# Altium schematic sheet Battery PSU.SchDoc
size A4
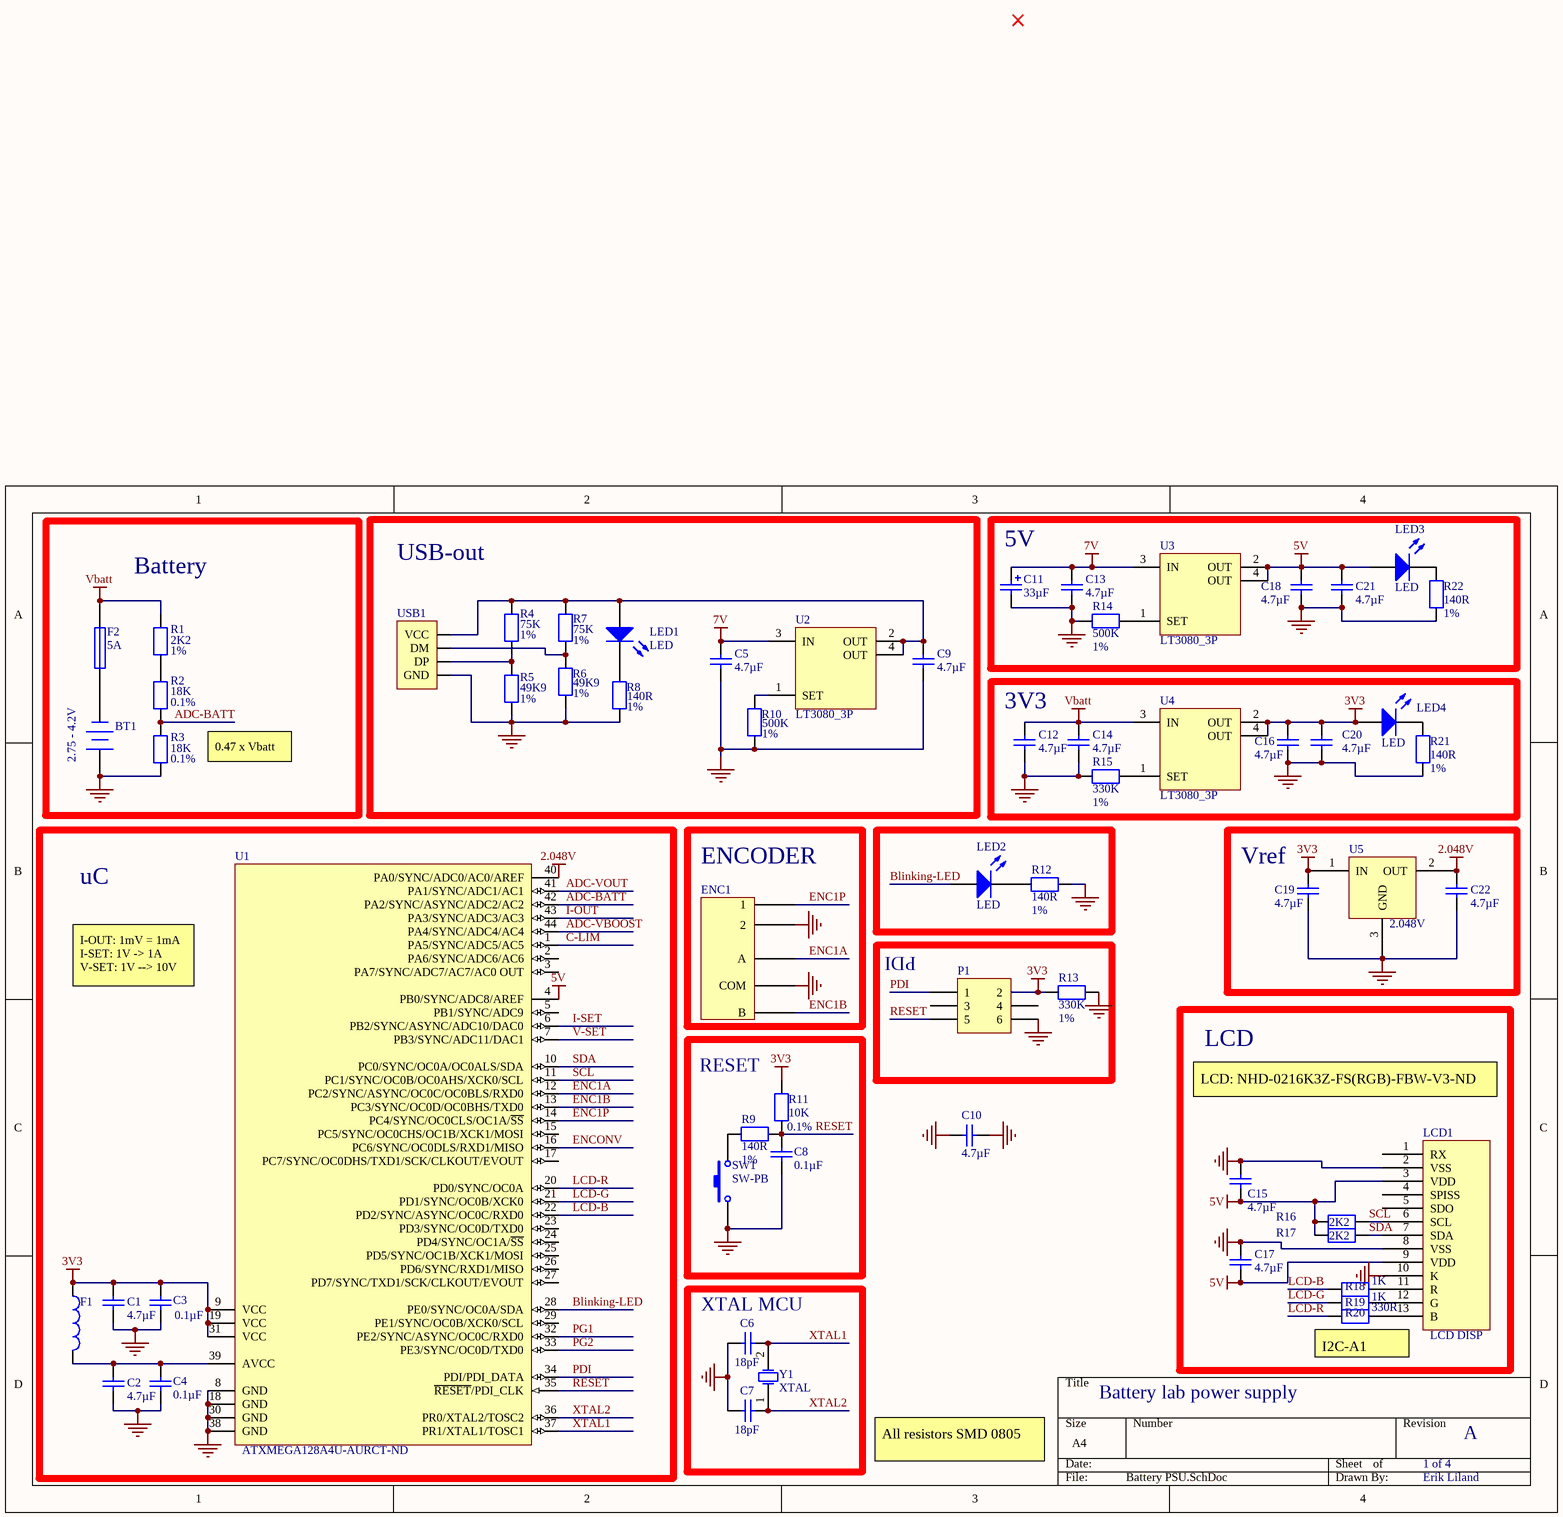
[diagram p0: Battery PSU.SchDoc]

## Parts
BT1  2.75 - 4.2V  [Quad battery holder]
C1  4.7µF  [0805_N_CAP]
C2  4.7µF  [0805_N_CAP]
C3  0.1µF  [0805_N_CAP]
C4  0.1µF  [0805_N_CAP]
C5  4.7µF  [0805_N_CAP]
C6  18pF  [0805_N_CAP]
C7  18pF  [0805_N_CAP]
C8  0.1µF  [0805_N_CAP]
C9  4.7µF  [0805_N_CAP]
C10  4.7µF  [0805_N_CAP]
C11  33µF  [CAP SMD (F)]
C12  4.7µF  [0805_N_CAP]
C13  4.7µF  [0805_N_CAP]
C14  4.7µF  [0805_N_CAP]
C15  4.7µF  [0805_N_CAP]
C16  4.7µF  [0805_N_CAP]
C17  4.7µF  [0805_N_CAP]
C18  4.7µF  [0805_N_CAP]
C19  4.7µF  [0805_N_CAP]
C20  4.7µF  [0805_N_CAP]
C21  4.7µF  [0805_N_CAP]
C22  4.7µF  [0805_N_CAP]
ENC1  RotEnc  [Bourns rotary encoder]  (value not drawn)
F1  200 Ohm @ 100MHz  [0805_N_FER]  (value not drawn)
F2  5A  [1812_N_FUSE]
LCD1  LCD DISP  [14P header]
LED1  LED  [0805_N_LED]
LED2  LED  [0805_N_LED]
LED3  LED  [0805_N_LED]
LED4  LED  [0805_N_LED]
P1  Header 3X2  [HDR2X3 SMD]  (value not drawn)
R1  2K2  Tolerance: 1%  [0805_N_RES]
R2  18K  Tolerance: 0.1%  [0805_N_RES]
R3  18K  Tolerance: 0.1%  [0805_N_RES]
R4  75K  Tolerance: 1%  [0805_N_RES]
R5  49K9  Tolerance: 1%  [0805_N_RES]
R6  49K9  Tolerance: 1%  [0805_N_RES]
R7  75K  Tolerance: 1%  [0805_N_RES]
R8  140R  Tolerance: 1%  [0805_N_RES]
R9  140R  Tolerance: 1%  [0805_N_RES]
R10  500K  Tolerance: 1%  [0805_N_RES]
R11  10K  Tolerance: 0.1%  [0805_N_RES]
R12  140R  Tolerance: 1%  [0805_N_RES]
R13  330K  Tolerance: 1%  [0805_N_RES]
R14  500K  Tolerance: 1%  [0805_N_RES]
R15  330K  Tolerance: 1%  [0805_N_RES]
R16  2K2  [0805_N_RES]
R17  2K2  [0805_N_RES]
R18  1K  [0805_N_RES]
R19  1K  [0805_N_RES]
R20  330R  [0805_N_RES]
R21  140R  Tolerance: 1%  [0805_N_RES]
R22  140R  Tolerance: 1%  [0805_N_RES]
SW1  SW-PB  [SW TACTILE]
U1  Supplier Part Number 1: ATXMEGA128A4U-AURCT-ND  [44A_N]  (hidden comment: ATxmega128A4-AU)
U2  LT3080_3P  [SOT223_N]
U3  LT3080_3P  [SOT223_N]
U4  LT3080_3P  [SOT223_N]
U5  2.048V  [SOT-23_N]
USB1  USB_A_VERT  [USB A VERT]  (value not drawn)
Y1  XTAL  [XTAL SMD]

## Blocks framed on the sheet
Battery: BT1 F2 R1-R3
USB-out: C5 C9 LED1 R4-R8 R10 U2 USB1
5V: C11 C13 C18 C21 LED3 R14 R22 U3
3V3: C12 C14 C16 C20 LED4 R15 R21 U4
uC: C1-C4 F1 U1
ENCODER: ENC1
Vref: C19 C22 U5
PDI: P1 R13
RESET: C8 R9 R11 SW1
LCD: C15 C17 LCD1 R16-R20
XTAL MCU: C6 C7 Y1

## Nets
2.048V: C22.1 U1.40(PA0/SYNC/ADC0/AC0/AREF) U5.2(OUT)
3V3: C1.1 C3.2 C16.1 C19.1 C20.1 F1.1 LED4.1(A) P1.2 R11.1 R13.2 U1.9(VCC) U1.19(VCC) U1.31(VCC) U4.2(OUT) U4.4(OUT) U5.1(IN)
5V: C15.2 C17.2 C18.1 C21.1 LCD1.3(VDD) LCD1.9(VDD) LED3.1(A) R16.2 R17.2 U1.4(PB0/SYNC/ADC8/AREF) U3.2(OUT) U3.4(OUT)
7V: C5.1 C11.1 C13.1 U2.3(IN) U3.3(IN)
GND: BT1.1(+) C1.2 C2.2 C3.1 C4.1 C5.2 C6.1 C7.1 C8.1 C9.2 C10.1 C10.2 C11.2 C12.2 C13.2 C14.2 C15.1 C16.2 C17.1 C18.2 C19.2 C20.2 C21.2 C22.2 ENC1.C(COM) ENC1.E(2) LCD1.2(VSS) LCD1.8(VSS) LCD1.10(K) P1.6 R3.2 R5.1 R6.1 R8.1 R10.1 R12.1 R13.1 R14.2 R15.2 R21.2 R22.2 SW1.1 U1.8(GND) U1.18(GND) U1.30(GND) U1.38(GND) U5.3(GND) USB1.4(GND)
Vbatt: C12.1 C14.1 F2.1 R1.2 U4.3(IN)
ADC-BATT: R2.2 R3.1 U1.42(PA2/SYNC/ASYNC/ADC2/AC2)
ADC-VBOOST: U1.44(PA4/SYNC/ADC4/AC4)
ADC-VOUT: U1.41(PA1/SYNC/ADC1/AC1)
Blinking-LED: LED2.1(A) U1.28(PE0/SYNC/OC0A/SDA)
C-LIM: U1.1(PA5/SYNC/ADC5/AC5)
ENC1A: ENC1.A U1.12(PC2/SYNC/ASYNC/OC0C/OC0BLS/RXD0)
ENC1B: ENC1.B U1.13(PC3/SYNC/OC0D/OC0BHS/TXD0)
ENC1P: ENC1.D(1) U1.14(PC4/SYNC/OC0CLS/OC1A/~{SS})
ENCONV: U1.16(PC6/SYNC/OC0DLS/RXD1/MISO)
I-OUT: U1.43(PA3/SYNC/ADC3/AC3)
I-SET: U1.6(PB2/SYNC/ASYNC/ADC10/DAC0)
LCD-B: R18.2 U1.22(PD2/SYNC/ASYNC/OC0C/RXD0)
LCD-G: R19.2 U1.21(PD1/SYNC/OC0B/XCK0)
LCD-R: R20.2 U1.20(PD0/SYNC/OC0A)
PDI: P1.1 U1.34(PDI/PDI_DATA)
PG1: U1.32(PE2/SYNC/ASYNC/OC0C/RXD0)
PG2: U1.33(PE3/SYNC/OC0D/TXD0)
RESET: C8.2 P1.5 R9.2 R11.2 U1.35(~{RESET}/PDI_CLK)
SCL: LCD1.6(SCL) R16.1 U1.11(PC1/SYNC/OC0B/OC0AHS/XCK0/SCL)
SDA: LCD1.7(SDA) R17.1 U1.10(PC0/SYNC/OC0A/OC0ALS/SDA)
V-SET: U1.7(PB3/SYNC/ADC11/DAC1)
XTAL1: C6.2 U1.37(PR1/XTAL1/TOSC1) Y1.2(OSC2)
XTAL2: C7.2 U1.36(PR0/XTAL2/TOSC2) Y1.1(OSC1)
NetBT1_2: BT1.2(-) F2.2
NetC2_1: C2.1 C4.2 F1.2 U1.39(AVCC)
NetC9_1: C9.1 LED1.1(A) R4.2 R7.2 U2.2(OUT) U2.4(OUT) USB1.1(VCC)
NetLCD1_11: LCD1.11(R) R18.1
NetLCD1_12: LCD1.12(G) R19.1
NetLCD1_13: LCD1.13(B) R20.1
NetLED1_2: LED1.2(K) R8.2
NetLED2_2: LED2.2(K) R12.2
NetLED3_2: LED3.2(K) R22.1
NetLED4_2: LED4.2(K) R21.1
NetR1_1: R1.1 R2.1
NetR4_1: R4.1 R5.2 USB1.3(DP)
NetR6_2: R6.2 R7.1 USB1.2(DM)
NetR9_1: R9.1 SW1.2
NetR10_2: R10.2 U2.1(SET)
NetR14_1: R14.1 U3.1(SET)
NetR15_1: R15.1 U4.1(SET)

Not connected (* = marked no-connect by the designer): LCD1 1(RX) 4(SPISS) 5(SDO); P1 3 4; U1 2(PA6/SYNC/ADC6/AC6) 3(PA7/SYNC/ADC7/AC7/AC0_OUT) 5(PB1/SYNC/ADC9) 15(PC5/SYNC/OC0CHS/OC1B/XCK1/MOSI) 17(PC7/SYNC/OC0DHS/TXD1/SCK/CLKOUT/EVOUT) 23(PD3/SYNC/OC0D/TXD0) 24(PD4/SYNC/OC1A/~{SS}) 25(PD5/SYNC/OC1B/XCK1/MOSI) 26(PD6/SYNC/RXD1/MISO) 27(PD7/SYNC/TXD1/SCK/CLKOUT/EVOUT) 29(PE1/SYNC/OC0B/XCK0/SCL)

## Notes on the sheet
- 0.47 x Vbatt
- (near U1) I-OUT: 1mV = 1mA
  I-SET: 1V -> 1A
  V-SET: 1V --> 10V
- LCD: NHD-0216K3Z-FS(RGB)-FBW-V3-ND
- Battery lab power supply
- I2C-A1
- All resistors SMD 0805
- 1 of 4
- A
- Erik Liland

## Library data of the parts
BT1 = Battery: Multicell Battery; Manufacturer: MPD (Memory Protection Devices); Manufacturer Part Number: BK-18650-PC8; Battery Type, Function: Cylindrical, Holder; Style: Holder (Open); Battery Cell Size: 18650; Number of Cells: 4; Published: 24-Mar-1999; LatestRevisionDate: 17-Jul-2002; LatestRevisionNote: Re-released for DXP Platform.; PackageReference: BAT-2; Publisher: Altium Limited; PackageDescription: Battery; 2 Leads; Supplier 1: Digi-Key; Supplier Part Number 1: BK-18650-PC8-ND; RoHS: RoHS Compliant; Category: Battery Products; Stock 1: 771; Pricing 1: 1=5.87, 10=5.436, 100=4.8966, 500=4.18678, 1000=3.7136 (EUR); Battery Series: -; Mounting Type: PCB, Through Hole; Termination Style: PC Pin; Height Above Board: 0.848" (21.54mm); Operating Temperature: -; ComponentLink1URL: http://www.memoryprotectiondevices.com/datasheets/BK-18650-PC8-datasheet.pdf; ComponentLink1Description: http://www.memoryprotectiondevices.com/datasheets/BK-18650-PC8-datasheet.pdf
C1 C2 C5 C9 C10 C12-C22 = Cap: Capacitor; Manufacturer: Samsung Electro-Mechanics America, Inc; Manufacturer Part Number: CL21B475KOFNFNE; Tolerance: ±10%; Voltage - Rated: 16V; Temperature Coefficient: X7R; Supplier 1: Digi-Key; Supplier Part Number 1: 1276-2970-1-ND; RoHS: RoHS Compliant; Category: Capacitors; Stock 1: 58798; Pricing 1: 1=0.27, 10=0.18, 25=0.1308, 100=0.0915, 500=0.06538, 1000=0.05557 (EUR); Packaging: Cut Tape (CT); Capacitance: 4.7µF; Mounting Type: Surface Mount, MLCC; Operating Temperature: -55°C ~ 125°C; Package / Case: 0805 (2012 Metric); Size / Dimension: 0.079" L x 0.049" W (2.00mm x 1.25mm); Height - Seated (Max): -; Thickness (Max): 0.053" (1.35mm); ComponentLink1URL: http://www.samsungsem.com/kr/front/downloadcms.do?path=/kr/support/product-search/mlcc/__icsFiles/afieldfile/2014/11/05&fileName=S_CL21B475KOFNFNE.pdf; ComponentLink1Description: http://www.samsungsem.com/kr/front/downloadcms.do?path=/kr/support/product-search/mlcc/__icsFiles/afieldfile/2014/11/05&fileName=S_CL21B475KOFNFNE.pdf
C3 = Cap: Capacitor; Manufacturer: Kemet; Manufacturer Part Number: C0805C104K4RACTU; Tolerance: ±10%; Voltage - Rated: 16V; Temperature Coefficient: X7R; Capacitance: 0.1µF; Category: Capacitors; Supplier 1: Digi-Key; Supplier Part Number 1: 399-1167-1-ND; RoHS: RoHS Compliant; Stock 1: 286232; Pricing 1: 1=0.11, 10=0.076, 50=0.0436, 100=0.0359, 250=0.03024, 500=0.02534, 1000=0.02081 (EUR); Packaging: Cut Tape (CT); Mounting Type: Surface Mount, MLCC; Operating Temperature: -55°C ~ 125°C; Package / Case: 0805 (2012 Metric); Size / Dimension: 0.079" L x 0.049" W (2.00mm x 1.25mm); Height - Seated (Max): -; Thickness (Max): 0.035" (0.88mm); ComponentLink1URL: http://www.kemet.com/docfinder?Partnumber=C0805C104K4RACTU; ComponentLink1Description: http://www.kemet.com/docfinder?Partnumber=C0805C104K4RACTU
C4 C8 = Cap: Capacitor; Manufacturer: Kemet; Manufacturer Part Number: C0805C104K4RACTU; Temperature Coefficient: X7R; Tolerance: ±10%; Voltage - Rated: 16V; Capacitance: 0.1µF; Category: Capacitors; ComponentLink1Description: http://www.kemet.com/docfinder?Partnumber=C0805C104K4RACTU; ComponentLink1URL: http://www.kemet.com/docfinder?Partnumber=C0805C104K4RACTU; Height - Seated (Max): -; Mounting Type: Surface Mount, MLCC; Operating Temperature: -55°C ~ 125°C; Package / Case: 0805 (2012 Metric); Packaging: Cut Tape (CT); Pricing 1: 1=0.11, 10=0.076, 50=0.0436, 100=0.0359, 250=0.03024, 500=0.02534, 1000=0.02081 (EUR); RoHS: RoHS Compliant; Size / Dimension: 0.079" L x 0.049" W (2.00mm x 1.25mm); Stock 1: 286232; Supplier 1: Digi-Key; Supplier Part Number 1: 399-1167-1-ND; Thickness (Max): 0.035" (0.88mm)
C6 C7 = Cap: Capacitor; Manufacturer: Samsung Electro-Mechanics America, Inc; Manufacturer Part Number: CL21C180GBANNNC; Tolerance: ±2%; Voltage - Rated: 50V; Temperature Coefficient: C0G, NP0; Supplier 1: Digi-Key; Supplier Part Number 1: 1276-2594-1-ND; RoHS: RoHS Compliant; Category: Capacitors; Stock 1: 4722; Pricing 1: 1=0.09, 10=0.069, 25=0.0488, 100=0.0315, 500=0.02208, 1000=0.0172 (EUR); Packaging: Cut Tape (CT); Capacitance: 18pF; Mounting Type: Surface Mount, MLCC; Operating Temperature: -55°C ~ 125°C; Package / Case: 0805 (2012 Metric); Size / Dimension: 0.079" L x 0.049" W (2.00mm x 1.25mm); Height - Seated (Max): -; Thickness (Max): 0.030" (0.75mm); ComponentLink1URL: http://www.samsungsem.com/kr/front/downloadcms.do?path=/kr/support/product-search/mlcc/__icsFiles/afieldfile/2014/11/05&fileName=S_CL21C180GBANNNC.pdf; ComponentLink1Description: http://www.samsungsem.com/kr/front/downloadcms.do?path=/kr/support/product-search/mlcc/__icsFiles/afieldfile/2014/11/05&fileName=S_CL21C180GBANNNC.pdf
C11 = Cap Pol: Polarized Capacitor; Manufacturer: Panasonic Electronic Components; Manufacturer Part Number: EEH-ZA1E330R; Tolerance: ±20%; ESR (Equivalent Series Resistance): 80 mOhm; Lifetime @ Temp.: 10000 Hrs @ 105°C; Type: Polymer - Hybrid; Ripple Current: 900mA; Surface Mount Land Size: 0.209" L x 0.209" W (5.30mm x 5.30mm); Voltage - Rated: 25V; Supplier 1: Digi-Key; Supplier Part Number 1: P15438CT-ND; RoHS: RoHS Compliant; Category: Capacitors; Stock 1: 7514; Pricing 1: 1=1.58, 10=1.291, 25=1.1648, 50=1.1332, 100=1.0389, 250=0.91296, 500=0.85 (EUR); Packaging: Cut Tape (CT); Capacitance: 33µF; Operating Temperature: -55°C ~ 105°C; Size / Dimension: 0.197" Dia (5.00mm); Height - Seated (Max): 0.240" (6.10mm); Mounting Type: Surface Mount; Package / Case: Radial, Can - SMD; ComponentLink1URL: http://industrial.panasonic.com/www-data/pdf/ABA0000/ABA0000CE136.pdf; ComponentLink1Description: http://industrial.panasonic.com/www-data/pdf/ABA0000/ABA0000CE136.pdf
ENC1 = RotEnc: RotaryEncoder; Manufacturer: Bourns Inc.; Manufacturer Part Number: PEC09-2220F-S0012; Encoder Type: Mechanical; Output Type: Quadrature (Incremental); Pulses per Revolution: 12; Actuator Type: 6mm Dia Flatted End; Detent: Yes; Rotational Life (Cycles Min): 30K; Supplier 1: Digi-Key; Supplier Part Number 1: PEC09-2220F-S0012-ND; RoHS: RoHS Compliant; Category: Sensors, Transducers; Stock 1: 620; Pricing 1: 1=3.29, 10=3.064, 25=2.8936, 50=2.5534, 100=2.0993, 250=2.04264, 500=1.92914, 1000=1.81567 (EUR); Voltage - Supply: -; Built in Switch: Yes; Mounting Type: Panel, PCB Through Hole; Orientation: Right Angle; Termination Style: PC Pin; ComponentLink1URL: http://www.bourns.com/data/global/pdfs/PEC09.pdf; ComponentLink1Description: http://www.bourns.com/data/global/pdfs/PEC09.pdf
F1 = Ferite: Ferrite Bead; Manufacturer: Laird-Signal Integrity Products; Manufacturer Part Number: LI0805G201R-10; Current Rating: 700mA; DC Resistance (DCR): 300 mOhm Max; Filter Type: Differential Mode - Single; Supplier 1: Digi-Key; Supplier Part Number 1: 240-2549-1-ND; RoHS: RoHS Compliant; Category: Filters; Stock 1: 42936; Pricing 1: 1=0.1, 10=0.065, 25=0.058, 50=0.0524, 100=0.0384, 250=0.02796, 500=0.02564, 1000=0.02213 (EUR); Packaging: Cut Tape (CT); Impedance @ Frequency: 200 Ohm @ 100MHz; Package / Case: 0805 (2012 Metric); Mounting Type: Surface Mount; Height (Max): 0.043" (1.10mm); Size / Dimension: 0.079" L x 0.049" W (2.00mm x 1.25mm); ComponentLink1URL: http://media.digikey.com/pdf/Data%20Sheets/Steward%20PDFs/FerriteEMI_ChipBeads_br.pdf; ComponentLink1Description: http://media.digikey.com/pdf/Data%20Sheets/Steward%20PDFs/FerriteEMI_ChipBeads_br.pdf
F2 = Fuse: Resetable fuse, SMD; Manufacturer: Bel Fuse Inc; Manufacturer Part Number: 0ZCG0260FF2C; Voltage - Max: 6V; Current - Max: 100A; Current - Hold (Ih) (Max): 2.6A; R Min/Max: 0.015 ~ 0.047 Ohm; Time to Trip: 2.5s; Supplier 1: Digi-Key; Supplier Part Number 1: 507-1778-1-ND; RoHS: RoHS Compliant; Category: Circuit Protection; Stock 1: 8506; Pricing 1: 1=0.17, 10=0.162, 25=0.15, 100=0.1348, 250=0.12008, 500=0.10006, 1000=0.09483 (EUR); Packaging: Cut Tape (CT); Current - Trip (It): 5A; Package / Case: 1812 (4532 Metric), Concave; ComponentLink1URL: http://www.belfuse.com/pdfs/0ZCG.pdf; ComponentLink1Description: http://www.belfuse.com/pdfs/0ZCG.pdf
LCD1 = LCD DISP: 2x16 CHAR DISP, RGB; Manufacturer: Sullins Connector Solutions; Manufacturer Part Number: SBH11-NBPC-D07-SM-BK; Connector Type: Header, Shrouded; Number of Positions: 14; Number of Positions Loaded: All; Pitch: 0.100" (2.54mm); Supplier 1: Digi-Key; Supplier Part Number 1: S9186-ND; RoHS: RoHS Compliant; Category: Connectors, Interconnects; Stock 1: 5015; Pricing 1: 1=1.47, 10=1.22, 25=1.1296, 50=1.0166, 100=0.9036, 250=0.79068, 500=0.72292, 1000=0.65514, 2500=0.58736 (EUR); Packaging: Tube; Contact Type: Male Pin; Number of Rows: 2; Row Spacing: 0.100" (2.54mm); Contact Mating Length: -; Mounting Type: Surface Mount; Termination: Solder; Fastening Type: -; Features: Polarizing Key; Contact Finish: Gold; Contact Finish Thickness: Flash; Color: Black; ComponentLink1URL: http://sullinscorp.com/catalogs/145_PAGE118_.100_SBH11_SERIES_MALE_BOX_HDR_ST_RA_SMT.pdf; ComponentLink1Description: http://sullinscorp.com/catalogs/145_PAGE118_.100_SBH11_SERIES_MALE_BOX_HDR_ST_RA_SMT.pdf
LED1-LED4 = LED: Typical RED, GREEN, YELLOW, AMBER; Manufacturer: OSRAM Opto Semiconductors Inc; Manufacturer Part Number: LG R971-KN-1; Wavelength - Dominant: 570nm; Wavelength - Peak: 572nm; Millicandela Rating: 26.05mcd; Voltage - Forward (Vf) (Typ): 2.2V; Current - Test: 20mA; Viewing Angle: 160°; Lens Style/Size: Rectangle with Flat Top, 1.30mm x 1.25mm; Lens Transparency: Diffused; Lens Color: White; Supplier 1: Digi-Key; Supplier Part Number 1: 475-1410-1-ND; RoHS: RoHS Compliant; Category: Optoelectronics; Stock 1: 152991; Pricing 1: 1=0.1, 10=0.087, 100=0.0691, 250=0.06048, 500=0.05526 (EUR); Packaging: Cut Tape (CT); Color: Green; Package / Case: 0805 (2012 Metric); Size / Dimension: 2.00mm L x 1.25mm W; Mounting Type: Surface Mount; ComponentLink1URL: http://www.osram-os.com/Graphics/XPic9/00078860_0.pdf; ComponentLink1Description: http://www.osram-os.com/Graphics/XPic9/00078860_0.pdf; Supplier Device Package: *; Height (Max): 0.90mm
P1 = Header 3X2: Header, 3-Pin, Dual row; Manufacturer: FCI; Manufacturer Part Number: 95278-101A06LF; Connector Type: Header, Unshrouded; Number of Positions: 6; Number of Positions Loaded: All; Pitch: 0.100" (2.54mm); Supplier 1: Digi-Key; RoHS: RoHS Compliant; Category: Connectors, Interconnects; Stock 1: 6353; Pricing 1: 1=1.11, 10=0.971, 25=0.914, 100=0.8381 (EUR); Packaging: Cut Tape (CT); Contact Type: Male Pin; Number of Rows: 2; Row Spacing: 0.100" (2.54mm); Contact Mating Length: 0.232" (5.90mm); Mounting Type: Surface Mount; Termination: Solder; Fastening Type: -; Features: -; Contact Finish: Gold, GXT™; Contact Finish Thickness: 30µin (0.76µm); Color: Black; ComponentLink1URL: http://portal.fciconnect.com/Comergent//fci/drawing/95278.pdf; ComponentLink1Description: http://portal.fciconnect.com/Comergent//fci/drawing/95278.pdf; Supplier Part Number 1: 609-3487-1-ND
R1 = Res: Resistor; Manufacturer: Samsung Electro-Mechanics America, Inc; Manufacturer Part Number: RC2012F222CS; Resistance (Ohms): 2.2k; Power (Watts): 0.125W, 1/8W; Temperature Coefficient: ±100ppm/°C; Value: 2K2; Supplier 1: Digi-Key; Supplier Part Number 1: 1276-5290-1-ND; RoHS: RoHS Compliant; Category: Resistors; Stock 1: 21595; Pricing 1: 1=0.1, 10=0.022, 25=0.016, 100=0.0092, 500=0.00558, 1000=0.00411, 2500=0.00358 (EUR); Packaging: Cut Tape (CT); Composition: Thick Film; Operating Temperature: -55°C ~ 155°C; Package / Case: 0805 (2012 Metric); Supplier Device Package: 0805 (2012 Metric); Size / Dimension: 0.079" L x 0.049" W (2.00mm x 1.25mm); Height: 0.024" (0.60mm); Number of Terminations: 2; ComponentLink1URL: http://www.samsungsem.com/global/support/library/product-catalog/__icsFiles/afieldfile/2015/01/12/CHIP_RESISTOR_150112_1.pdf; ComponentLink1Description: http://www.samsungsem.com/global/support/library/product-catalog/__icsFiles/afieldfile/2015/01/12/CHIP_RESISTOR_150112_1.pdf
R2 R3 = Res: Resistor; Manufacturer: Panasonic Electronic Components; Manufacturer Part Number: ERA-6AEB183V; Power (Watts): 0.125W, 1/8W; Temperature Coefficient: ±25ppm/°C; Value: 18K; Category: Resistors; ComponentLink1Description: http://industrial.panasonic.com/www-cgi/jvcr13pz.cgi?E+PZ+3+AOA0026+ERA6AEB183V+7+WW; ComponentLink1URL: http://industrial.panasonic.com/www-cgi/jvcr13pz.cgi?E+PZ+3+AOA0026+ERA6AEB183V+7+WW; Composition: Thin Film; Height: 0.024" (0.60mm); Number of Terminations: 2; Operating Temperature: -55°C ~ 155°C; Package / Case: 0805 (2012 Metric); Packaging: Cut Tape (CT); Pricing 1: 1=0.64, 50=0.2516, 100=0.194, 250=0.15092, 500=0.10636, 1000=0.07761 (EUR); Resistance (Ohms): 18k; RoHS: RoHS Compliant; Size / Dimension: 0.079" L x 0.049" W (2.00mm x 1.25mm); Stock 1: 21371; Supplier 1: Digi-Key; Supplier Device Package: 0805; Supplier Part Number 1: P18KDACT-ND
R4 R7 R10 R14 = Res: Resistor; Category: Resistors
  R4 R7: Value: 75K
  R10 R14: Value: 500K
R5 R6 = Res: Resistor; Manufacturer: Samsung Electro-Mechanics America, Inc; Manufacturer Part Number: RC2012F4992CS; Resistance (Ohms): 49.9k; Power (Watts): 0.125W, 1/8W; Temperature Coefficient: ±100ppm/°C; Value: 49K9; Supplier 1: Digi-Key; Supplier Part Number 1: 1276-5378-1-ND; RoHS: RoHS Compliant; Category: Resistors; Stock 1: 1527; Pricing 1: 1=0.1, 10=0.022, 25=0.016, 100=0.0092, 500=0.00558, 1000=0.00411, 2500=0.00358 (EUR); Packaging: Cut Tape (CT); Composition: Thick Film; Operating Temperature: -55°C ~ 155°C; Package / Case: 0805 (2012 Metric); Supplier Device Package: 0805 (2012 Metric); Size / Dimension: 0.079" L x 0.049" W (2.00mm x 1.25mm); Height: 0.024" (0.60mm); Number of Terminations: 2; ComponentLink1URL: http://www.samsungsem.com/global/support/library/product-catalog/__icsFiles/afieldfile/2015/01/12/CHIP_RESISTOR_150112_1.pdf; ComponentLink1Description: http://www.samsungsem.com/global/support/library/product-catalog/__icsFiles/afieldfile/2015/01/12/CHIP_RESISTOR_150112_1.pdf
R8 = Res: Resistor; Manufacturer: Samsung Electro-Mechanics America, Inc; Manufacturer Part Number: RC2012F1400CS; Power (Watts): 0.125W, 1/8W; Resistance (Ohms): 140; Temperature Coefficient: ±100ppm/°C; Value: 140R; Category: Resistors; ComponentLink1Description: http://www.samsungsem.com/global/support/library/product-catalog/__icsFiles/afieldfile/2015/01/12/CHIP_RESISTOR_150112_1.pdf; ComponentLink1URL: http://www.samsungsem.com/global/support/library/product-catalog/__icsFiles/afieldfile/2015/01/12/CHIP_RESISTOR_150112_1.pdf; Composition: Thick Film; Height: 0.024" (0.60mm); Number of Terminations: 2; Operating Temperature: -55°C ~ 155°C; Package / Case: 0805 (2012 Metric); Packaging: Cut Tape (CT); Pricing 1: 1=0.1, 10=0.022, 25=0.016, 100=0.0092, 500=0.00558, 1000=0.00411, 2500=0.00358 (EUR); RoHS: RoHS Compliant; Size / Dimension: 0.079" L x 0.049" W (2.00mm x 1.25mm); Stock 1: 7060; Supplier 1: Digi-Key; Supplier Device Package: 0805 (2012 Metric); Supplier Part Number 1: 1276-5229-1-ND
R9 R12 R21 R22 = Res: Resistor; Manufacturer: Samsung Electro-Mechanics America, Inc; Manufacturer Part Number: RC2012F1400CS; Resistance (Ohms): 140; Power (Watts): 0.125W, 1/8W; Temperature Coefficient: ±100ppm/°C; Value: 140R; Supplier 1: Digi-Key; Supplier Part Number 1: 1276-5229-1-ND; RoHS: RoHS Compliant; Category: Resistors; Stock 1: 7060; Pricing 1: 1=0.1, 10=0.022, 25=0.016, 100=0.0092, 500=0.00558, 1000=0.00411, 2500=0.00358 (EUR); Packaging: Cut Tape (CT); Composition: Thick Film; Operating Temperature: -55°C ~ 155°C; Package / Case: 0805 (2012 Metric); Supplier Device Package: 0805 (2012 Metric); Size / Dimension: 0.079" L x 0.049" W (2.00mm x 1.25mm); Height: 0.024" (0.60mm); Number of Terminations: 2; ComponentLink1URL: http://www.samsungsem.com/global/support/library/product-catalog/__icsFiles/afieldfile/2015/01/12/CHIP_RESISTOR_150112_1.pdf; ComponentLink1Description: http://www.samsungsem.com/global/support/library/product-catalog/__icsFiles/afieldfile/2015/01/12/CHIP_RESISTOR_150112_1.pdf
R11 = Res: Resistor; Manufacturer: TE Connectivity AMP Connectors; Manufacturer Part Number: 8-1614884-4; Power (Watts): 0.1W, 1/10W; Temperature Coefficient: ±25ppm/°C; Value: 10K; Category: Resistors; ComponentLink1Description: http://www.te.com/commerce/DocumentDelivery/DDEController?Action=srchrtrv&DocNm=1773200&DocType=DS&DocLang=English; ComponentLink1URL: http://www.te.com/commerce/DocumentDelivery/DDEController?Action=srchrtrv&DocNm=1773200&DocType=DS&DocLang=English; Composition: Thin Film; Height: 0.026" (0.65mm); Number of Terminations: 2; Operating Temperature: -55°C ~ 155°C; Package / Case: 0805 (2012 Metric); Packaging: Cut Tape (CT); Pricing 1: 1=0.18, 100=0.1714, 500=0.16136 (EUR); Resistance (Ohms): 10k; RoHS: RoHS Compliant; Size / Dimension: 0.079" L x 0.049" W (2.00mm x 1.25mm); Stock 1: 18690; Supplier 1: Digi-Key; Supplier Device Package: 0805; Supplier Part Number 1: A103142CT-ND
R13 R15 = Res: Resistor; Manufacturer: Samsung Electro-Mechanics America, Inc; Manufacturer Part Number: RC2012F331CS; Resistance (Ohms): 330; Power (Watts): 0.125W, 1/8W; Temperature Coefficient: ±100ppm/°C; Value: 330K; Supplier Part Number 1: 1276-5246-1-ND; RoHS: RoHS Compliant; Category: Resistors; Stock 1: 12915; Pricing 1: 1=0.1, 10=0.022, 25=0.016, 100=0.0092, 500=0.00558, 1000=0.00411, 2500=0.00358 (EUR); Packaging: Cut Tape (CT); Composition: Thick Film; Operating Temperature: -55°C ~ 155°C; Package / Case: 0805 (2012 Metric); Supplier Device Package: 0805 (2012 Metric); Size / Dimension: 0.079" L x 0.049" W (2.00mm x 1.25mm); Height: 0.024" (0.60mm); Number of Terminations: 2; ComponentLink1URL: http://www.samsungsem.com/global/support/library/product-catalog/__icsFiles/afieldfile/2015/01/12/CHIP_RESISTOR_150112_1.pdf; ComponentLink1Description: http://www.samsungsem.com/global/support/library/product-catalog/__icsFiles/afieldfile/2015/01/12/CHIP_RESISTOR_150112_1.pdf
  R13: Supplier 1: Digi-Key
R16 R17 = Res: Resistor; Manufacturer: Samsung Electro-Mechanics America, Inc; Manufacturer Part Number: RC2012F222CS; Tolerance: 1%; Power (Watts): 0.125W, 1/8W; Resistance (Ohms): 2.2k; Temperature Coefficient: ±100ppm/°C; Value: 2K2; Category: Resistors; ComponentLink1Description: http://www.samsungsem.com/global/support/library/product-catalog/__icsFiles/afieldfile/2015/01/12/CHIP_RESISTOR_150112_1.pdf; ComponentLink1URL: http://www.samsungsem.com/global/support/library/product-catalog/__icsFiles/afieldfile/2015/01/12/CHIP_RESISTOR_150112_1.pdf; Composition: Thick Film; Height: 0.024" (0.60mm); Number of Terminations: 2; Operating Temperature: -55°C ~ 155°C; Package / Case: 0805 (2012 Metric); Packaging: Cut Tape (CT); Pricing 1: 1=0.1, 10=0.022, 25=0.016, 100=0.0092, 500=0.00558, 1000=0.00411, 2500=0.00358 (EUR); RoHS: RoHS Compliant; Size / Dimension: 0.079" L x 0.049" W (2.00mm x 1.25mm); Stock 1: 21595; Supplier 1: Digi-Key; Supplier Device Package: 0805 (2012 Metric); Supplier Part Number 1: 1276-5290-1-ND
R18 R19 = Res: Resistor; Manufacturer: Panasonic Electronic Components; Manufacturer Part Number: ERA-6AEB102V; Tolerance: 0.1%; Power (Watts): 0.125W, 1/8W; Temperature Coefficient: ±25ppm/°C; Value: 1K; Category: Resistors; ComponentLink1Description: http://industrial.panasonic.com/www-cgi/jvcr13pz.cgi?E+PZ+3+AOA0026+ERA6AEB102V+7+WW; ComponentLink1URL: http://industrial.panasonic.com/www-cgi/jvcr13pz.cgi?E+PZ+3+AOA0026+ERA6AEB102V+7+WW; Composition: Thin Film; Height: 0.024" (0.60mm); Number of Terminations: 2; Operating Temperature: -55°C ~ 155°C; Package / Case: 0805 (2012 Metric); Packaging: Cut Tape (CT); Pricing 1: 1=0.64, 50=0.2516, 100=0.194, 250=0.15092, 500=0.10636, 1000=0.07761 (EUR); Resistance (Ohms): 1k; RoHS: RoHS Compliant; Size / Dimension: 0.079" L x 0.049" W (2.00mm x 1.25mm); Stock 1: 142110; Supplier 1: Digi-Key; Supplier Device Package: 0805; Supplier Part Number 1: P1.0KDACT-ND
R20 = Res: Resistor; Manufacturer: Samsung Electro-Mechanics America, Inc; Manufacturer Part Number: RC2012F331CS; Tolerance: 1%; Resistance (Ohms): 330; Power (Watts): 0.125W, 1/8W; Temperature Coefficient: ±100ppm/°C; Value: 330R; Supplier 1: Digi-Key; Supplier Part Number 1: 1276-5246-1-ND; RoHS: RoHS Compliant; Category: Resistors; Stock 1: 12915; Pricing 1: 1=0.1, 10=0.022, 25=0.016, 100=0.0092, 500=0.00558, 1000=0.00411, 2500=0.00358 (EUR); Packaging: Cut Tape (CT); Composition: Thick Film; Operating Temperature: -55°C ~ 155°C; Package / Case: 0805 (2012 Metric); Supplier Device Package: 0805 (2012 Metric); Size / Dimension: 0.079" L x 0.049" W (2.00mm x 1.25mm); Height: 0.024" (0.60mm); Number of Terminations: 2; ComponentLink1URL: http://www.samsungsem.com/global/support/library/product-catalog/__icsFiles/afieldfile/2015/01/12/CHIP_RESISTOR_150112_1.pdf; ComponentLink1Description: http://www.samsungsem.com/global/support/library/product-catalog/__icsFiles/afieldfile/2015/01/12/CHIP_RESISTOR_150112_1.pdf
SW1 = SW-PB: Switch; Manufacturer: C&K Components; Manufacturer Part Number: PTS645SK50SMTR92 LFS; Circuit: SPST-NO; Switch Function: Off-Mom; Contact Rating @ Voltage: 0.05A @ 12VDC; Actuator Type: Standard; Actuator Height off PCB, from Pins: 5.00mm; Actuator Orientation: Top Actuated; Outline: 6.00mm x 6.00mm; Illumination: Non-Illuminated; Operating Force: 260gf; Actuator Material: Polyamide (PA66), Nylon 6/6; Mechanical Life: 100,000 Cycles; Supplier 1: Digi-Key; Supplier Part Number 1: P16767CT-ND; RoHS: RoHS Compliant; Category: Switches; Stock 1: 26870; Pricing 1: 1=0.75, 10=0.699, 25=0.6288, 50=0.5592, 100=0.5358, 250=0.48924, 500=0.46594, 1000=0.3844 (EUR); Packaging: Cut Tape (CT); Mounting Type: Surface Mount; Termination Style: Gull Wing; Illumination Voltage (Nominal): -; Illumination Type, Color: -; Ingress Protection: -; Features: -; Switch Travel: -; Operating Temperature: -20°C ~ 60°C; ComponentLink1URL: http://www.ck-components.com/14409/pts645_25apr13.pdf/; ComponentLink1Description: http://www.ck-components.com/14409/pts645_25apr13.pdf/; Published: 24-Mar-1999; LatestRevisionDate: 17-Jul-2002; LatestRevisionNote: Re-released for DXP Platform.; PackageReference: SPST-2; Publisher: Altium Limited; PackageDescription: Switch; 2 Leads; ComponentLink2URL: http://industrial.panasonic.com/www-cgi/jvcr13pz.cgi?E+PZ+2+ATK0020+0+4+WW; ComponentLink2Description: http://industrial.panasonic.com/www-cgi/jvcr13pz.cgi?E+PZ+2+ATK0020+0+4+WW
U1 = CMP-0094-00040-4: 8/16-bit AVR XMEGA A4 Microcontroller, 1.6-3.6V, 32MHz, 128KB + 8KB Flash, 2KB EEPROM, 8KB SRAM, 44-pin TQFP, Industrial Grade (-40°C to 85°C), Pb-Free; Manufacturer: Atmel; Manufacturer Part Number: ATXMEGA128A4U-AUR; Connectivity: I²C, IrDA, SPI, UART/USART, USB; Peripherals: Brown-out Detect/Reset, DMA, POR, PWM, WDT; Number of I/O: 34; Program Memory Size: 128KB (64K x 16); EEPROM Size: 2K x 8; RAM Size: 8K x 8; Voltage - Supply (Vcc/Vdd): 1.6 V ~ 3.6 V; Data Converters: A/D 12x12b, D/A 2x12b; Oscillator Type: Internal; Supplier 1: Digi-Key; RoHS: RoHS Compliant; Category: Integrated Circuits (ICs); Stock 1: 3287; Pricing 1: 1=4.97, 10=4.451, 25=4.0028, 100=3.6402, 250=3.2952, 500=2.95016 (EUR); Packaging: Cut Tape (CT); Core Processor: AVR; Core Size: 8/16-Bit; Speed: 32MHz; Program Memory Type: FLASH; Operating Temperature: -40°C ~ 85°C; Package / Case: 44-TQFP; Supplier Device Package: 44-TQFP (10x10)
U2-U4 = LT3080_3P: LT3080 LDO regulator; Manufacturer: Linear Technology; Manufacturer Part Number: LT3080EST#TRPBF; Regulator Topology: Positive Adjustable; Voltage - Output: 0 V ~ 36 V; Current - Output: 1.1A; Voltage - Dropout (Typical): 1.35V @ 1.1A; Number of Regulators: 1; Voltage - Input: 1.2 V ~ 36 V; Supplier 1: Digi-Key; Supplier Part Number 1: LT3080EST#TRPBFCT-ND; RoHS: RoHS Compliant; Category: Integrated Circuits (ICs); Stock 1: 1918; Pricing 1: 1=4.49, 25=4.01, 100=3.609 (EUR); Packaging: Cut Tape (CT); Current - Limit (Min): 1.1A; Operating Temperature: -40°C ~ 125°C; Mounting Type: Surface Mount; Package / Case: TO-261-4, TO-261AA; Supplier Device Package: SOT-223; ComponentLink1URL: http://www.linear.com/docs/25276; ComponentLink1Description: http://www.linear.com/docs/25276
U5 = ISL21010: Voltage reference; Manufacturer: Intersil; Manufacturer Part Number: ISL21010CFH320Z-TK; Reference Type: Series; Output Type: Fixed; Current - Output: 25mA; Tolerance: ±0.2%; Temperature Coefficient: 50ppm/°C; Noise - 0.1Hz to 10Hz: 58µVp-p; Noise - 10Hz to 10kHz: 26µVrms; Voltage - Input: 2.2 V ~ 5.5 V; Current - Supply: 80µA; Supplier 1: Digi-Key; Supplier Part Number 1: ISL21010CFH320Z-TKCT-ND; RoHS: RoHS Compliant; Category: Integrated Circuits (ICs); Stock 1: 329; Pricing 1: 1=1.81, 25=1.2808, 100=1.0892 (EUR); Packaging: Cut Tape (CT); Voltage - Output (Min/Fixed): 2.048V; Voltage - Output (Max): -; Current - Cathode: -; Operating Temperature: -40°C ~ 125°C (TA); Mounting Type: Surface Mount; Package / Case: TO-236-3, SC-59, SOT-23-3; Supplier Device Package: SOT-23-3; ComponentLink1URL: http://www.intersil.com/content/dam/Intersil/documents/fn78/fn7896.pdf; ComponentLink1Description: http://www.intersil.com/content/dam/Intersil/documents/fn78/fn7896.pdf
USB1 = USB_A_VERT: USB A Vertikal; Manufacturer: Assmann WSW Components; Manufacturer Part Number: A-USB/2-A-E-R; Connector Type: USB - A; Number of Contacts: 4; Gender: Receptacle; Specifications: USB 2.0; Supplier 1: Digi-Key; Supplier Part Number 1: AE10400-ND; RoHS: RoHS Compliant; Category: Connectors, Interconnects; Stock 1: 0; Pricing 1: 1=1.26, 10=1.108, 25=1.0432, 50=0.9998, 100=0.9563, 250=0.86936, 500=0.78242, 1000=0.69548, 2500=0.63028 (EUR); Packaging: Bulk; Mounting Type: Through Hole, Right Angle, Vertical; Features: Board Lock; Ingress Protection: -; ComponentLink1URL: http://www.assmann.us/specs/A-USB_2-A-E-R.pdf; ComponentLink1Description: http://www.assmann.us/specs/A-USB_2-A-E-R.pdf
Y1 = XTAL: Crystal Oscillator; Manufacturer: ECS Inc; Manufacturer Part Number: ECS-80-18-20BQ-DS; Frequency: 8MHz; Frequency Stability: ±100ppm; Frequency Tolerance: ±30ppm; Load Capacitance: 18pF; ESR (Equivalent Series Resistance): 60 Ohm; Operating Mode: Fundamental; Supplier 1: Digi-Key; Supplier Part Number 1: XC2015CT-ND; RoHS: RoHS Compliant; Category: Crystals and Oscillators; Stock 1: 1735; Pricing 1: 1=1.93, 10=1.672, 50=1.466, 100=1.1573, 500=0.97726 (EUR); Packaging: Cut Tape (CT); Type: MHz Crystal; Operating Temperature: -40°C ~ 125°C; Ratings: AEC-Q200; Mounting Type: Surface Mount; Package / Case: 4-SMD, No Lead (DFN, LCC); Size / Dimension: 0.276" L x 0.197" W (7.00mm x 5.00mm); Height: 0.051" (1.30mm); ComponentLink1URL: http://www.ecsxtal.com/store/pdf/CSM-8Q.pdf; ComponentLink1Description: http://www.ecsxtal.com/store/pdf/CSM-8Q.pdf; Published: 8-Jun-2000; LatestRevisionDate: 17-Jul-2002; LatestRevisionNote: Re-released for DXP Platform.; PackageReference: R38; Publisher: Altium Limited; PackageDescription: Crystal, Thru-Hole; 2 Leads; Body 3.1 x 8.2 mm (Dia.xH)